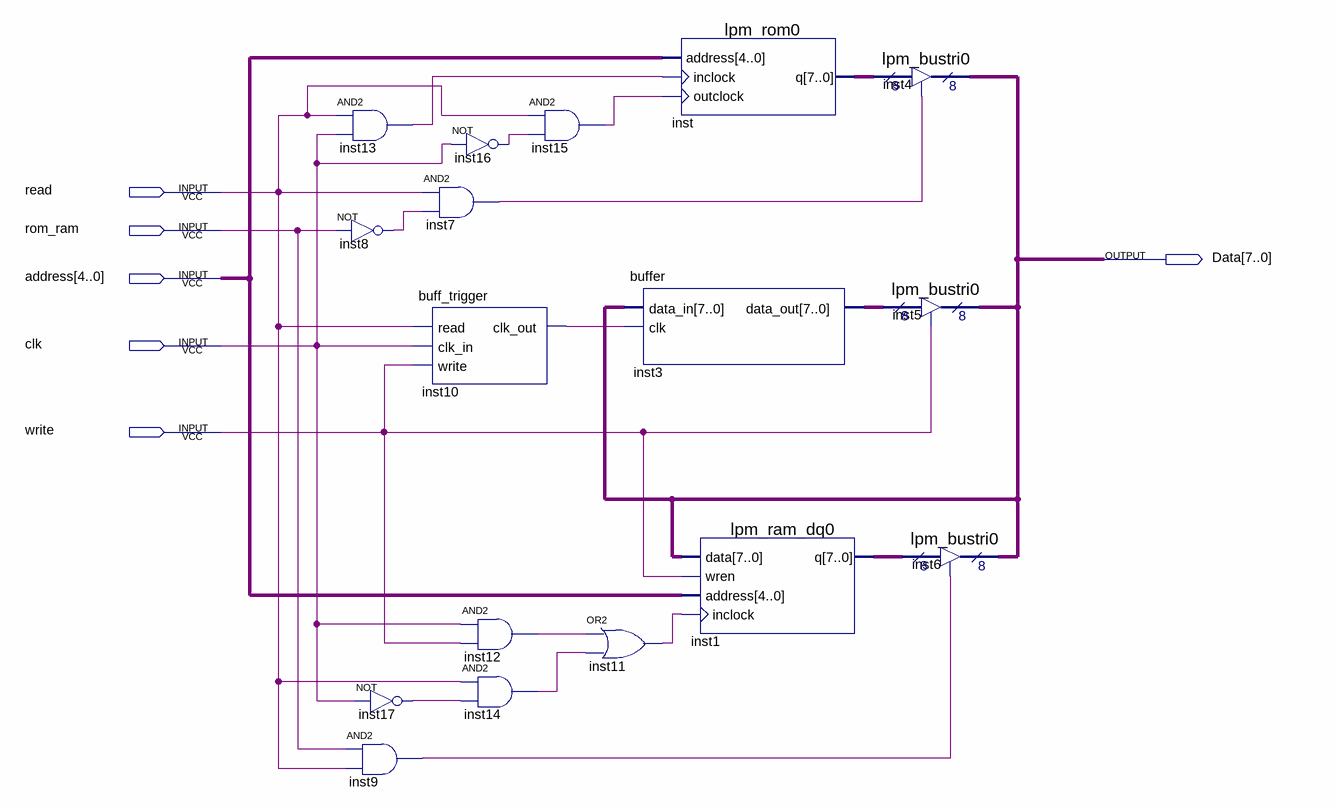
[diagram p0: schematic sheet]
// Quartus schematic lab3.bdf as structural Verilog: 17 symbols, 6 pins
module lab3 (
  input  read,
  input  rom_ram,
  input  [4:0] address,
  input  clk,
  input  write,
  output [7:0] Data
);

  wire inst7_out, inst8_out, inst9_out, inst10_clk_out, inst11_out, inst12_out, inst13_out, inst14_out,
       inst15_out, inst16_out, inst17_out;
  wire [7:0] inst1_q, inst3_data_out, inst_q;

  and inst13 (inst13_out, read, clk);
  not inst8 (inst8_out, rom_ram);
  and inst9 (inst9_out, rom_ram, read);
  and inst7 (inst7_out, read, inst8_out);
  buff_trigger inst10 (.read(read), .clk_in(clk), .write(write), .clk_out(inst10_clk_out));
  not inst17 (inst17_out, clk);
  not inst16 (inst16_out, clk);
  and inst12 (inst12_out, clk, write);
  and inst14 (inst14_out, read, inst17_out);
  and inst15 (inst15_out, read, inst16_out);
  buffer inst3 (.data_in(Data), .clk(inst10_clk_out), .data_out(inst3_data_out));
  or inst11 (inst11_out, inst12_out, inst14_out);
  lpm_rom0 inst (.address(address), .inclock(inst13_out), .outclock(inst15_out), .q(inst_q));
  lpm_ram_dq0 inst1 (.data(Data), .wren(write), .address(address), .inclock(inst11_out), .q(inst1_q));
  lpm_bustri0 inst4 (.enabledt(inst7_out), .data(inst_q), .tridata(Data));
  lpm_bustri0 inst5 (.enabledt(write), .data(inst3_data_out), .tridata(Data));
  lpm_bustri0 inst6 (.enabledt(inst9_out), .data(inst1_q), .tridata(Data));
endmodule
